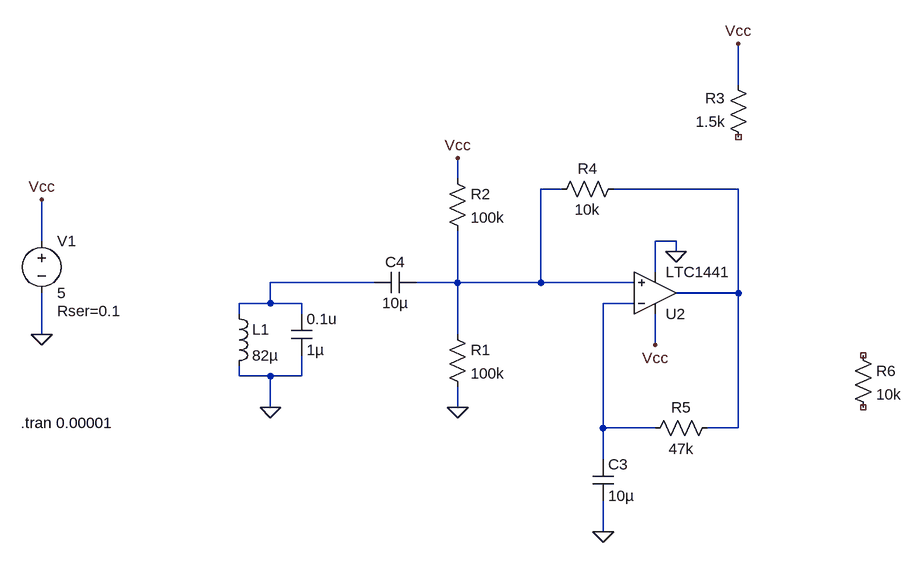
[diagram p0: schematic Draft1.asc]
Draft1.asc, the LTspice schematic file:
Version 4
SHEET 1 1224 680
WIRE 816 -256 816 -320
WIRE 384 -112 384 -144
WIRE 544 -96 512 -96
WIRE 816 -96 624 -96
WIRE -256 -16 -256 -80
WIRE 720 -16 688 -16
WIRE 720 0 720 -16
WIRE 688 32 688 -16
WIRE 256 48 96 48
WIRE 384 48 384 -32
WIRE 384 48 320 48
WIRE 512 48 512 -96
WIRE 512 48 384 48
WIRE 656 48 512 48
WIRE 816 64 816 -96
WIRE 816 64 720 64
WIRE 96 80 96 48
WIRE 96 80 48 80
WIRE 144 80 96 80
WIRE 656 80 608 80
WIRE 48 96 48 80
WIRE 144 96 144 80
WIRE -256 128 -256 64
WIRE 384 128 384 48
WIRE 688 144 688 96
WIRE 48 192 48 176
WIRE 96 192 48 192
WIRE 144 192 144 160
WIRE 144 192 96 192
WIRE 96 240 96 192
WIRE 384 240 384 208
WIRE 608 272 608 80
WIRE 688 272 608 272
WIRE 816 272 816 64
WIRE 816 272 768 272
WIRE 608 320 608 272
WIRE 608 432 608 384
FLAG 96 240 0
FLAG 384 240 0
FLAG -256 128 0
FLAG -256 -80 Vcc
FLAG 384 -144 Vcc
FLAG 720 0 0
FLAG 688 144 Vcc
FLAG 816 -320 Vcc
FLAG 608 432 0
SYMBOL ind 32 80 R0
SYMATTR InstName L1
SYMATTR Value 82µ
SYMBOL cap 128 96 R0
SYMATTR InstName 0.1u
SYMATTR Value 1µ
SYMBOL res 368 112 R0
SYMATTR InstName R1
SYMATTR Value 100k
SYMBOL res 368 -128 R0
SYMATTR InstName R2
SYMATTR Value 100k
SYMBOL voltage -256 -32 R0
WINDOW 123 0 0 Left 0
WINDOW 39 24 124 Left 2
SYMATTR InstName V1
SYMATTR Value 5
SYMATTR SpiceLine Rser=0.1
SYMBOL res 832 -160 R180
WINDOW 0 36 76 Left 2
WINDOW 3 36 40 Left 2
SYMATTR InstName R3
SYMATTR Value 1.5k
SYMBOL res 640 -112 R90
WINDOW 0 0 56 VBottom 2
WINDOW 3 32 56 VTop 2
SYMATTR InstName R4
SYMATTR Value 10k
SYMBOL res 784 256 R90
WINDOW 0 0 56 VBottom 2
WINDOW 3 32 56 VTop 2
SYMATTR InstName R5
SYMATTR Value 47k
SYMBOL cap 592 320 R0
SYMATTR InstName C3
SYMATTR Value 10µ
SYMBOL cap 320 32 R90
WINDOW 0 0 32 VBottom 2
WINDOW 3 32 32 VTop 2
SYMATTR InstName C4
SYMATTR Value 10µ
SYMBOL res 992 144 R0
SYMATTR InstName R6
SYMATTR Value 10k
SYMBOL Comparators\\LTC1441 688 128 M180
SYMATTR InstName U2
TEXT -288 264 Left 2 !.tran 0.00001

The netlist it stands for:
* Draft1.asc
L1 N003 0 82µ
C§0.1u N003 0 1µ
R1 N001 0 100k
R2 Vcc N001 100k
V1 Vcc 0 5 Rser=0.1
R3 NC_01 Vcc 1.5k
R4 N002 N001 10k
R5 N002 N004 47k
C3 N004 0 10µ
C4 N001 N003 10µ
R6 NC_02 NC_03 10k
XU2 N001 N004 Vcc 0 N002 LTC1441  ; pins In+ In- V+ V- OUT
.tran 0.00001
.backanno
.end